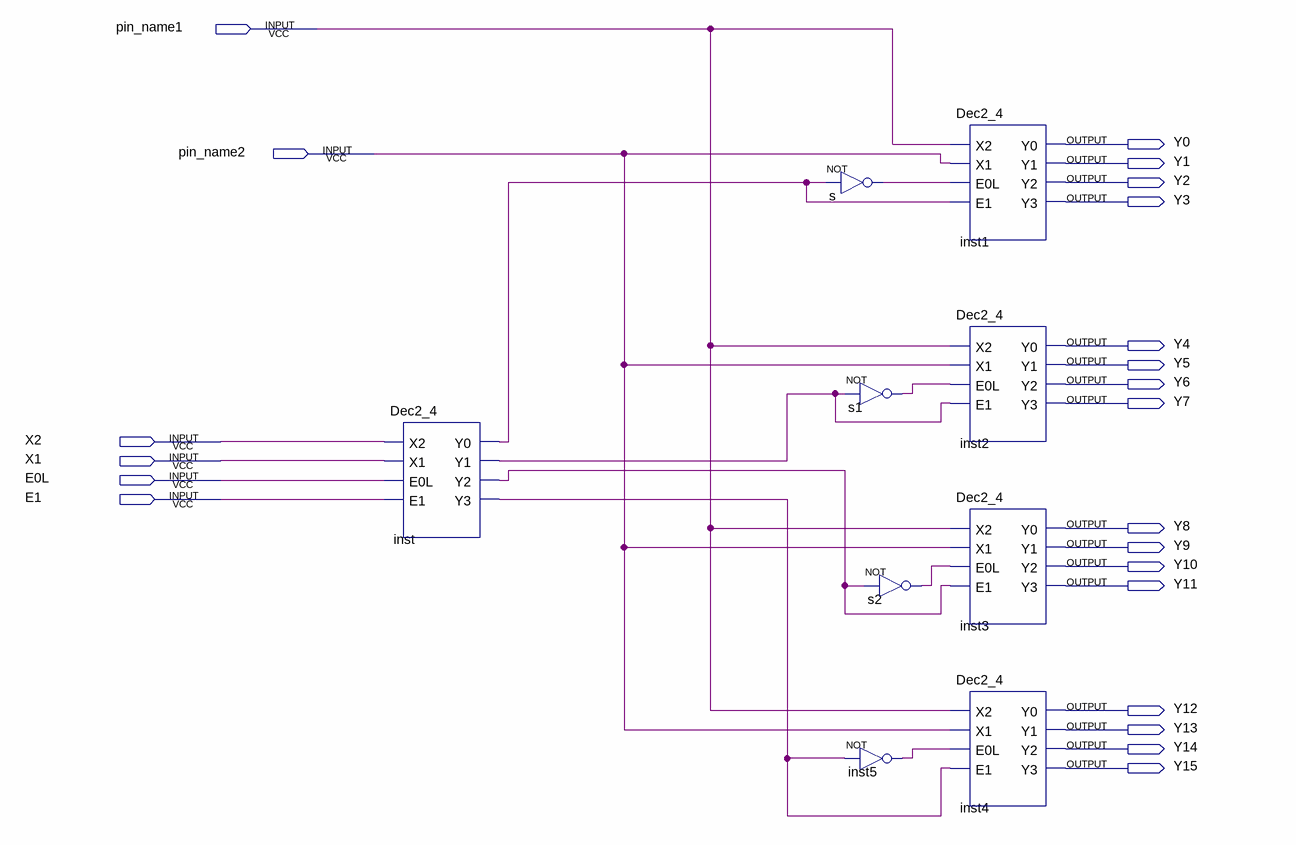
[diagram p0: schematic sheet]
// Quartus schematic Dec4_16.bdf as structural Verilog: 9 symbols, 22 pins
module Dec4_16 (
  input  pin_name1,
  input  pin_name2,
  input  X2,
  input  X1,
  input  E0L,
  input  E1,
  output Y0,
  output Y1,
  output Y2,
  output Y3,
  output Y4,
  output Y5,
  output Y6,
  output Y7,
  output Y8,
  output Y9,
  output Y10,
  output Y11,
  output Y12,
  output Y13,
  output Y14,
  output Y15
);

  wire inst5_out, inst_y0, inst_y1, inst_y2, inst_y3, s1_out, s2_out, s_out;

  Dec2_4 inst (.X2(X2), .X1(X1), .E0L(E0L), .E1(E1), .Y0(inst_y0), .Y1(inst_y1), .Y2(inst_y2), .Y3(inst_y3));
  not s (s_out, inst_y0);
  not s1 (s1_out, inst_y1);
  not s2 (s2_out, inst_y2);
  not inst5 (inst5_out, inst_y3);
  Dec2_4 inst1 (.X2(pin_name1), .X1(pin_name2), .E0L(s_out), .E1(inst_y0), .Y0(Y0), .Y1(Y1), .Y2(Y2), .Y3(Y3));
  Dec2_4 inst2 (.X2(pin_name1), .X1(pin_name2), .E0L(s1_out), .E1(inst_y1), .Y0(Y4), .Y1(Y5), .Y2(Y6), .Y3(Y7));
  Dec2_4 inst3 (.X2(pin_name1), .X1(pin_name2), .E0L(s2_out), .E1(inst_y2), .Y0(Y8), .Y1(Y9), .Y2(Y10), .Y3(Y11));
  Dec2_4 inst4 (.X2(pin_name1), .X1(pin_name2), .E0L(inst5_out), .E1(inst_y3), .Y0(Y12), .Y1(Y13), .Y2(Y14), .Y3(Y15));
endmodule
